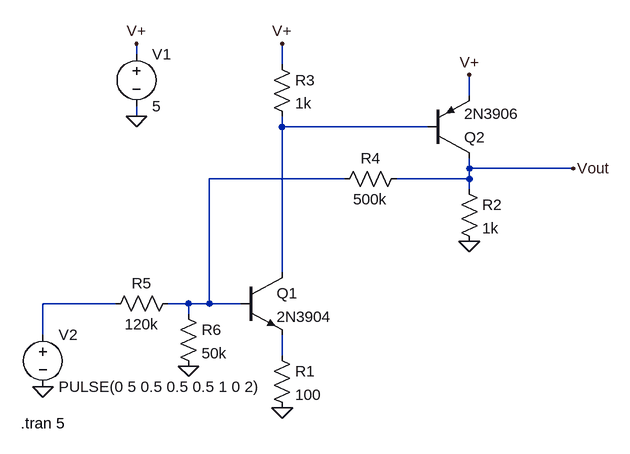
[diagram p0: schematic 10A-05.asc]
10A-05.asc, the LTspice schematic file:
Version 4
SHEET 1 880 680
WIRE 48 -160 48 -176
WIRE 272 -144 272 -176
WIRE 560 -96 560 -128
WIRE 48 -64 48 -80
WIRE 272 -48 272 -64
WIRE 496 -48 272 -48
WIRE 560 16 560 0
WIRE 720 16 560 16
WIRE 368 32 160 32
WIRE 560 32 560 16
WIRE 560 32 448 32
WIRE 560 48 560 32
WIRE 272 176 272 -48
WIRE 16 224 -96 224
WIRE 128 224 96 224
WIRE 160 224 160 32
WIRE 160 224 128 224
WIRE 208 224 160 224
WIRE 128 240 128 224
WIRE -96 272 -96 224
WIRE 272 304 272 272
FLAG 48 -64 0
FLAG 48 -176 V+
FLAG 272 -176 V+
FLAG 560 -128 V+
FLAG 272 384 0
FLAG 560 128 0
FLAG -96 352 0
FLAG 720 16 Vout
FLAG 128 320 0
SYMBOL npn 208 176 R0
SYMATTR InstName Q1
SYMATTR Value 2N3904
SYMBOL pnp 496 0 M180
SYMATTR InstName Q2
SYMATTR Value 2N3906
SYMBOL res 256 288 R0
SYMATTR InstName R1
SYMATTR Value 100
SYMBOL res 544 32 R0
SYMATTR InstName R2
SYMATTR Value 1k
SYMBOL res 256 -160 R0
SYMATTR InstName R3
SYMATTR Value 1k
SYMBOL res 464 16 R90
WINDOW 0 0 56 VBottom 2
WINDOW 3 32 56 VTop 2
SYMATTR InstName R4
SYMATTR Value 500k
SYMBOL res 112 208 R90
WINDOW 0 0 56 VBottom 2
WINDOW 3 32 56 VTop 2
SYMATTR InstName R5
SYMATTR Value 120k
SYMBOL voltage 48 -176 R0
WINDOW 123 0 0 Left 0
WINDOW 39 0 0 Left 0
SYMATTR InstName V1
SYMATTR Value 5
SYMBOL voltage -96 256 R0
WINDOW 123 0 0 Left 0
WINDOW 39 0 0 Left 0
SYMATTR InstName V2
SYMATTR Value PULSE(0 5 0.5 0.5 0.5 1 0 2)
SYMBOL res 112 224 R0
SYMATTR InstName R6
SYMATTR Value 50k
TEXT -130 408 Left 2 !.tran 5

The netlist it stands for:
* 10A-05.asc
Q1 N001 N002 N004 0 2N3904
Q2 Vout N001 V+ 0 2N3906
R1 N004 0 100
R2 Vout 0 1k
R3 V+ N001 1k
R4 Vout N002 500k
R5 N002 N003 120k
V1 V+ 0 5
V2 N003 0 PULSE(0 5 0.5 0.5 0.5 1 0 2)
R6 N002 0 50k
.model NPN NPN
.model PNP PNP
.lib standard.bjt
.tran 5
.backanno
.end